# EAGLE design Controller (EAGLE 9.1.1)
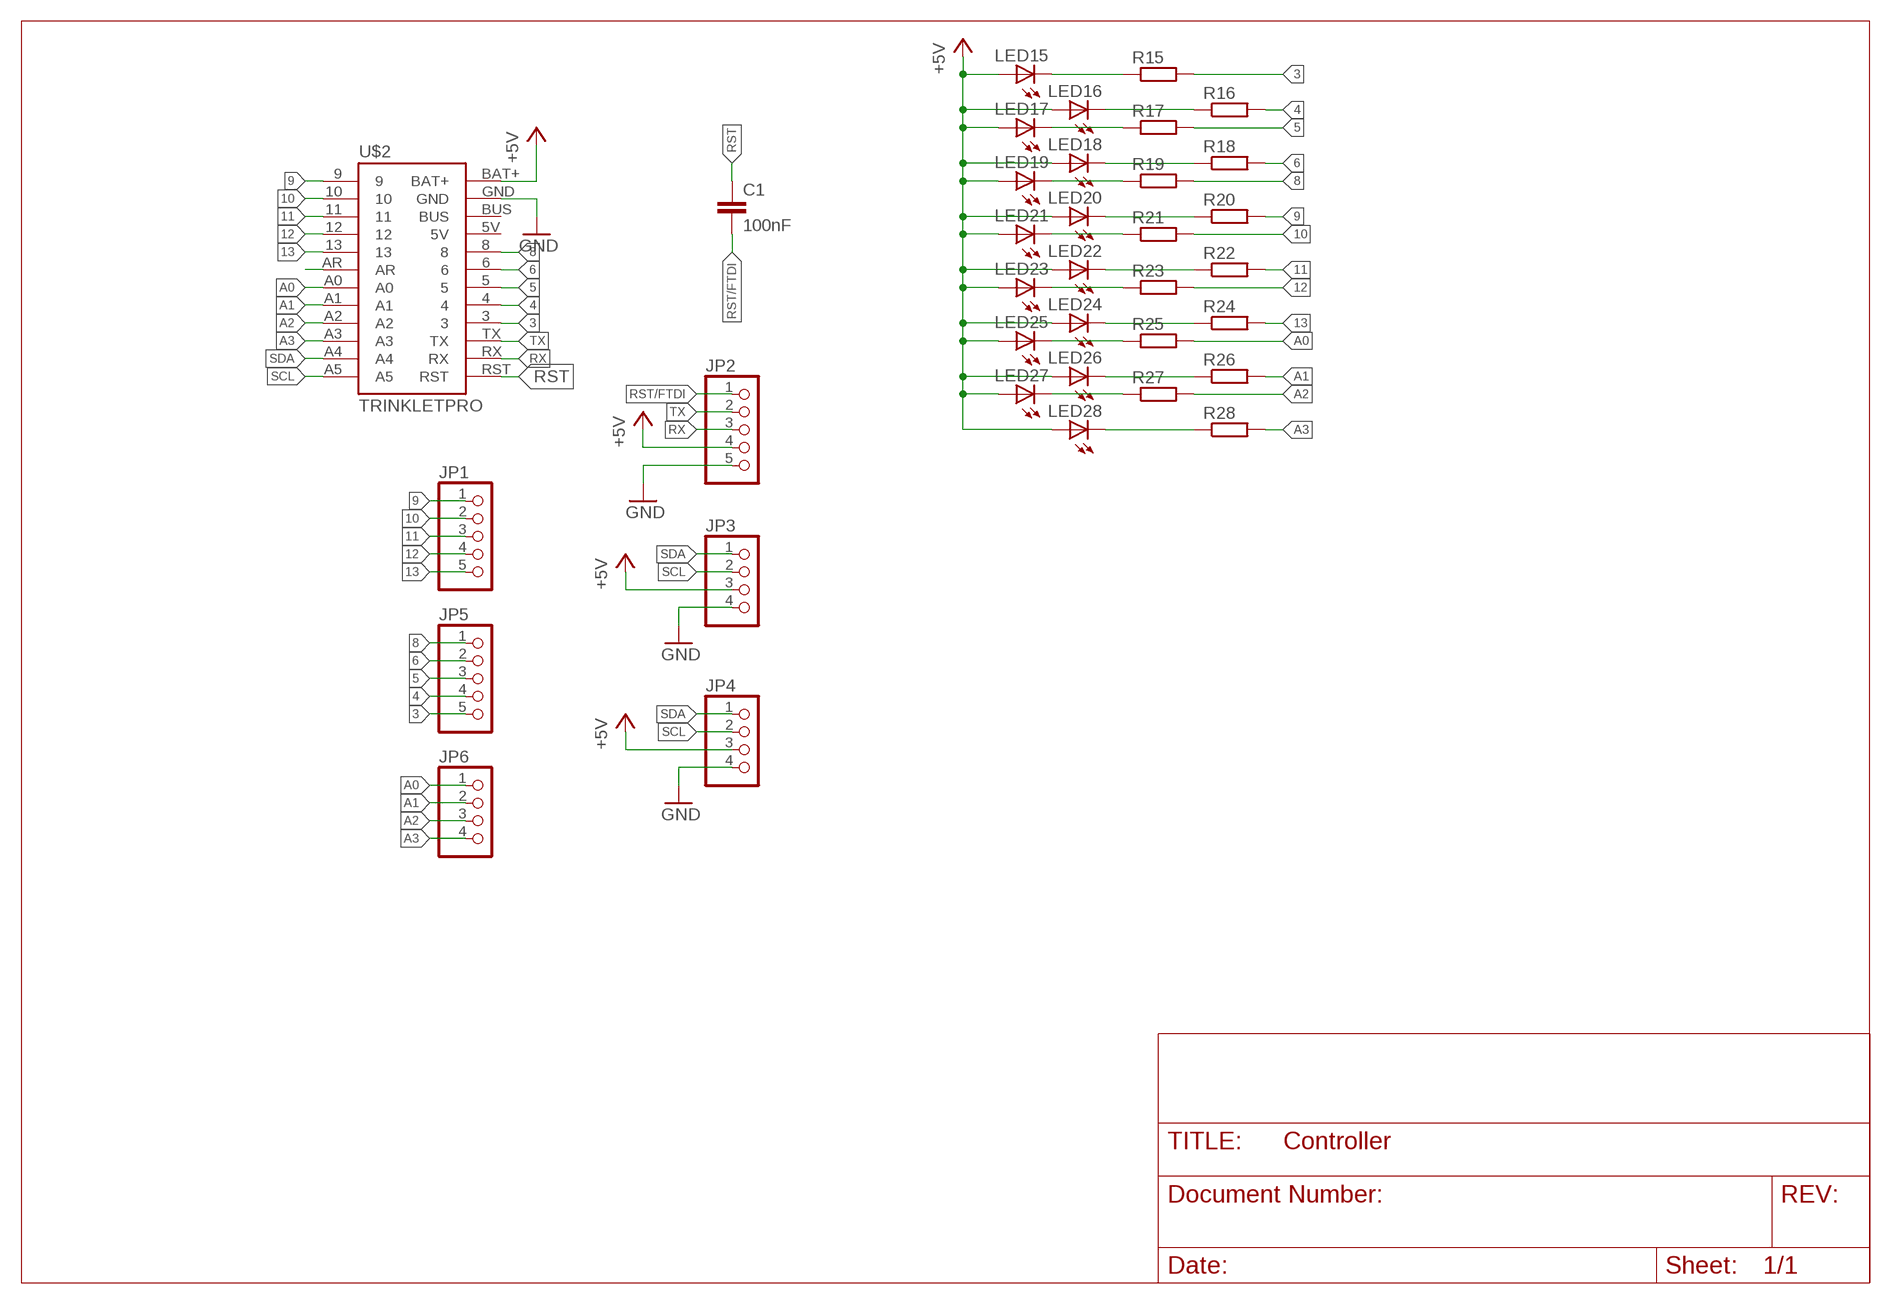
[diagram p0: schematic, sheet 1]

## Parts
C1  100nF  C-EUC0805  [C0805]
JP1  PINHD-1X5  [1X05]
JP2  PINHD-1X5  [1X05]
JP3  PINHD-1X4  [1X04]
JP4  PINHD-1X4  [1X04]
JP5  PINHD-1X5  [1X05]
JP6  PINHD-1X4  [1X04]
LED15  LEDCHIP-LED0805  [CHIP-LED0805]
LED16  LEDCHIP-LED0805  [CHIP-LED0805]
LED17  LEDCHIP-LED0805  [CHIP-LED0805]
LED18  LEDCHIP-LED0805  [CHIP-LED0805]
LED19  LEDCHIP-LED0805  [CHIP-LED0805]
LED20  LEDCHIP-LED0805  [CHIP-LED0805]
LED21  LEDCHIP-LED0805  [CHIP-LED0805]
LED22  LEDCHIP-LED0805  [CHIP-LED0805]
LED23  LEDCHIP-LED0805  [CHIP-LED0805]
LED24  LEDCHIP-LED0805  [CHIP-LED0805]
LED25  LEDCHIP-LED0805  [CHIP-LED0805]
LED26  LEDCHIP-LED0805  [CHIP-LED0805]
LED27  LEDCHIP-LED0805  [CHIP-LED0805]
LED28  LEDCHIP-LED0805  [CHIP-LED0805]
R15  R-EU_R0805  [R0805]
R16  R-EU_R0805  [R0805]
R17  R-EU_R0805  [R0805]
R18  R-EU_R0805  [R0805]
R19  R-EU_R0805  [R0805]
R20  R-EU_R0805  [R0805]
R21  R-EU_R0805  [R0805]
R22  R-EU_R0805  [R0805]
R23  R-EU_R0805  [R0805]
R24  R-EU_R0805  [R0805]
R25  R-EU_R0805  [R0805]
R26  R-EU_R0805  [R0805]
R27  R-EU_R0805  [R0805]
R28  R-EU_R0805  [R0805]
U$2  TRINKLETPRO  [1X12]

## Nets
3: JP5.5 R15.2 U$2.3
4: JP5.4 R16.2 U$2.4
5: JP5.3 R17.2 U$2.5
6: JP5.2 R18.2 U$2.6
8: JP5.1 R19.2 U$2.8
9: JP1.1 R20.2 U$2.9
10: JP1.2 R21.2 U$2.10
11: JP1.3 R22.2 U$2.11
12: JP1.4 R23.2 U$2.12
13: JP1.5 R24.2 U$2.13
+5V: JP2.4 JP3.3 JP4.3 LED15.A LED16.A LED17.A LED18.A LED19.A LED20.A LED21.A LED22.A LED23.A LED24.A LED25.A LED26.A LED27.A LED28.A U$2.BAT+
A0: JP6.1 R25.2 U$2.A0
A1: JP6.2 R26.2 U$2.A1
A2: JP6.3 R27.2 U$2.A2
A3: JP6.4 R28.2 U$2.A3
GND: JP2.5 JP3.4 JP4.4 U$2.GND
N$16: U$2.AR
N$17: LED15.C R15.1
N$18: LED16.C R16.1
N$19: LED17.C R17.1
N$20: LED18.C R18.1
N$21: LED19.C R19.1
N$22: LED20.C R20.1
N$23: LED21.C R21.1
N$24: LED22.C R22.1
N$25: LED23.C R23.1
N$26: LED24.C R24.1
N$27: LED25.C R25.1
N$28: LED26.C R26.1
N$29: LED27.C R27.1
N$30: LED28.C R28.1
RST: C1.1 U$2.RST
RST/FTDI: C1.2 JP2.1
RX: JP2.3 U$2.RX
SCL: JP3.2 JP4.2 U$2.A5
SDA: JP3.1 JP4.1 U$2.A4
TX: JP2.2 U$2.TX
Unconnected: U$2.5V U$2.BUS

## Library data of the parts
C1 = rcl:C-EU: CAPACITOR, European symbol; SPICEPREFIX: C
JP1 JP2 JP5 = pinhead:PINHD-1X5: PIN HEADER
JP3 JP4 JP6 = pinhead:PINHD-1X4: PIN HEADER
LED15-LED28 = led:LED: LED OSRAM: - CHIPLED LG R971, LG N971, LY N971, LG Q971, LY Q971, LO R971, LY R971 LH N974, LH R974 LS Q976, LO Q976, LY Q976 LO Q996 - Hyper CHIPLED LW Q18S LB Q993, LB Q99A, LB R99A - SideLED LS A670, LO A670, LY A670, LG A670, LP A670 LB A673, LV A673, LT A673, LW A673 LH A674 LY A675 LS A676, LA A676, LO A676, LY A676, LW A676 LS A679, LY A679, LG A679 - Hyper Micro SIDELED® LS Y876, LA Y876, LO Y876, LY Y876 LT Y87S - SmartLED LW L88C, LW L88S LB L89C, LB L89S, LG L890 LS L89K, LO L89K, LY L89K LS L896, LA L896, LO L896, LY L896 - TOPLED LS T670, LO T670, LY T670, LG T670, LP T670 LSG T670, LSP T670, LSY T670, LOP T670, LYG T670 LG T671, LOG T671, LSG T671 LB T673, LV T673, LT T673, LW T673 LH T674 LS T676, LA T676, LO T676, LY T676, LB T676, LH T676, LSB T676, LW T676 LB T67C, LV T67C, LT T67C, LS T67K, LO T67K, LY T67K, LW E67C LS E67B, LA E67B, LO E67B, LY E67B, LB E67C, LV E67C, LT E67C LW T67C LS T679, LY T679, LG T679 LS T770, LO T770, LY T770, LG T770, LP T770 LB T773, LV T773, LT T773, LW T773 LH T774 LS E675, LA E675, LY E675, LS T675 LS T776, LA T776, LO T776, LY T776, LB T776 LHGB T686 LT T68C, LB T68C - Hyper Mini TOPLED® LB M676 - Mini TOPLED Santana® LG M470 LS M47K, LO M47K, LY M47K Source: http://www.osram.convergy.de LUXEON: - LUMILED® LXK2-PW12-R00, LXK2-PW12-S00, LXK2-PW14-U00, LXK2-PW14-V00 LXK2-PM12-R00, LXK2-PM12-S00, LXK2-PM14-U00 LXK2-PE12-Q00, LXK2-PE12-R00, LXK2-PE12-S00, LXK2-PE14-T00, LXK2-PE14-U00 LXK2-PB12-K00, LXK2-PB12-L00, LXK2-PB12-M00, LXK2-PB14-N00, LXK2-PB14-P00, LXK2-PB14-Q00 LXK2-PR12-L00, LXK2-PR12-M00, LXK2-PR14-Q00, LXK2-PR14-R00 LXK2-PD12-Q00, LXK2-PD12-R00, LXK2-PD12-S00 LXK2-PH12-R00, LXK2-PH12-S00 LXK2-PL12-P00, LXK2-PL12-Q00, LXK2-PL12-R00 Source: www.luxeon.com KINGBRIGHT: KA-3528ASYC Source: www.kingbright.com
R15-R28 = rcl:R-EU_: RESISTOR, European symbol; SPICEPREFIX: R
U$2 = KLAUS:TRINKLETPRO

## Board
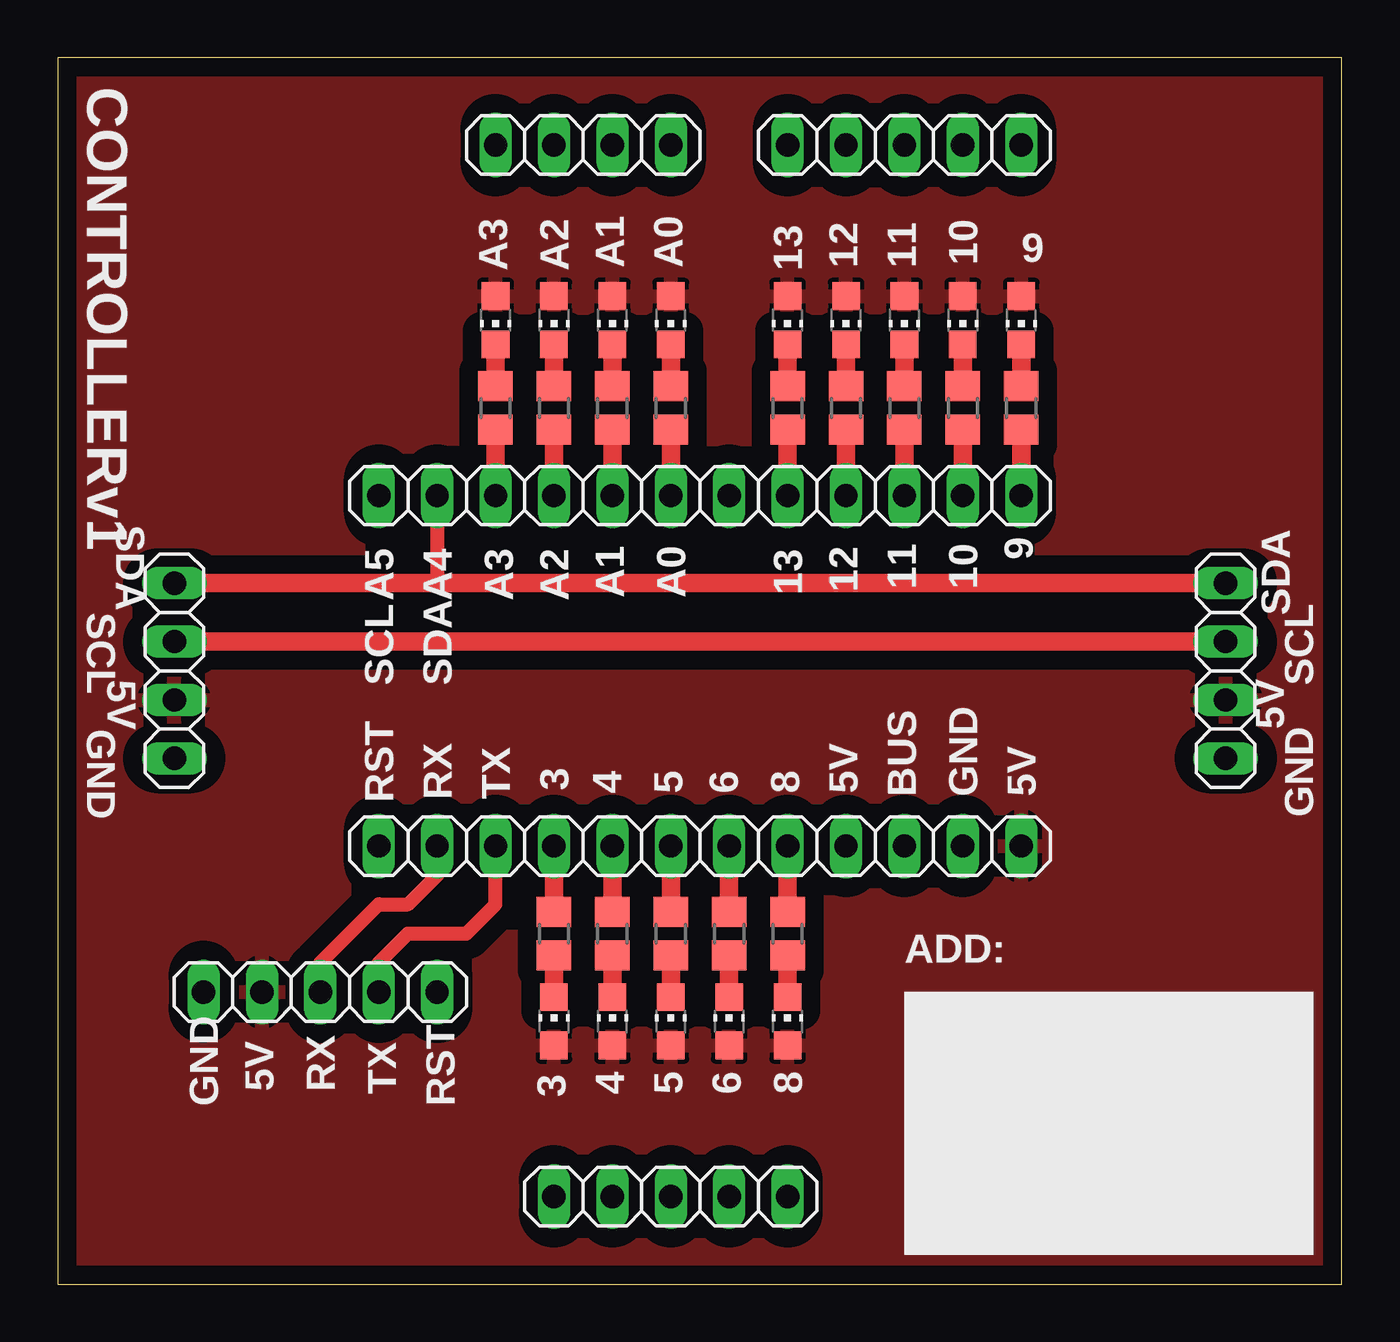
[diagram p1: board, top side]
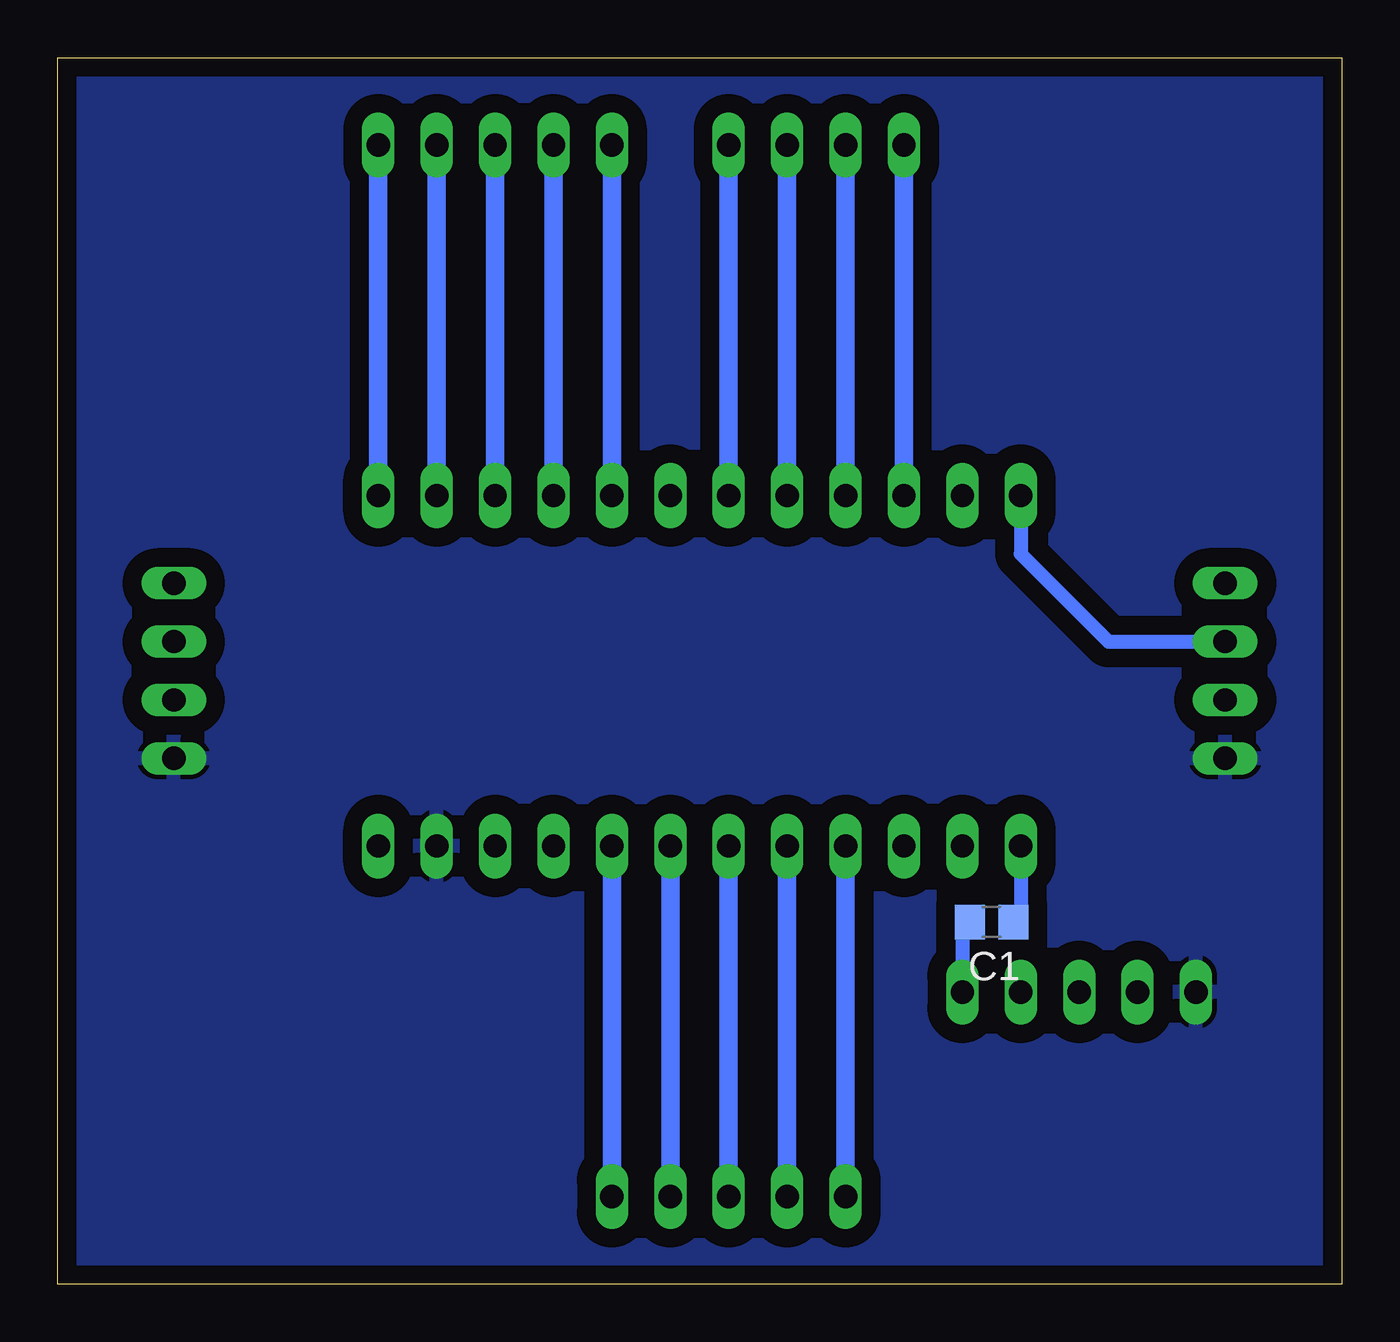
[diagram p2: board, bottom side, seen from below]

Size 55.86 x 53.34 mm. Coordinates in mm from the lower left corner, seen from the top.
Outline: 0,0 55.86,0 55.86,53.34 0,53.34 0,0
Copper layers (1*16): Top 0.035mm / dielectric 1.5mm / Bottom 0.035mm
Design rules "PCB-POOL Standard": minimum track width 0.15mm, minimum drill 0.3mm, track to track 0.15mm, track to pad 0.15mm, pad to pad 0.15mm, via to via 0.15mm, smd to smd 0.15mm, copper to edge 0.3mm, drill to drill 0.2mm, minimum pad ring 0.2mm, minimum via ring 0.15mm, stop-mask expansion 0.075mm, vias tented up to drill 0mil, thermal gap 0.2mm

### Footprints (pad centres in the part's own frame; a part is rotated, then mirrored left to right if it is on the bottom)
C0805 = smd 1.3 x 1.5: 1 -0.95,0; 2 0.95,0
1X05 = drill 1.016 long: 1 -5.08,0; 2 -2.54,0; 3 0,0; 4 2.54,0; 5 5.08,0
1X04 = drill 1.016 long: 1 -3.81,0; 2 -1.27,0; 3 1.27,0; 4 3.81,0
CHIP-LED0805 = smd 1.2 x 1.2: A 0,-1.05; C 0,1.05
R0805 = smd 1.3 x 1.5: 1 -0.95,0; 2 0.95,0
1X12 = drill 1.016 long: 3 7.62,-6.35; 4 7.62,-3.81; 5 7.62,-1.27; 5V 7.62,6.35; 6 7.62,1.27; 8 7.62,3.81; 9 -7.62,13.97; 10 -7.62,11.43; 11 -7.62,8.89; 12 -7.62,6.35; 13 -7.62,3.81; A0 -7.62,-1.27; A1 -7.62,-3.81; A2 -7.62,-6.35; A3 -7.62,-8.89; A4 -7.62,-11.43; A5 -7.62,-13.97; AR -7.62,1.27; BAT+ 7.62,13.97; BUS 7.62,8.89; GND 7.62,11.43; RST 7.62,-13.97; RX 7.62,-11.43; TX 7.62,-8.89

### Placement (x,y rotation side)
C1  15.24,15.75 180 bottom
JP1  36.83,49.53 180 top
JP2  11.43,12.7 180 top
JP3  5.08,26.67 270 top
JP4  50.8,26.67 270 top
JP5  26.67,3.81 180 top
JP6  22.86,49.53 180 top
LED15  21.59,11.43 0 top
LED16  24.13,11.43 0 top
LED17  26.67,11.43 0 top
LED18  29.21,11.43 0 top
LED19  31.75,11.43 0 top
LED20  41.91,41.91 180 top
LED21  39.37,41.91 180 top
LED22  36.83,41.91 180 top
LED23  34.29,41.91 180 top
LED24  31.75,41.91 180 top
LED25  26.67,41.91 180 top
LED26  24.13,41.91 180 top
LED27  21.59,41.91 180 top
LED28  19.05,41.91 180 top
R15  21.59,15.24 90 top
R16  24.13,15.24 90 top
R17  26.67,15.24 90 top
R18  29.21,15.24 90 top
R19  31.75,15.24 90 top
R20  41.91,38.1 270 top
R21  39.37,38.1 270 top
R22  36.83,38.1 270 top
R23  34.29,38.1 270 top
R24  31.75,38.1 270 top
R25  26.67,38.1 270 top
R26  24.13,38.1 270 top
R27  21.59,38.1 270 top
R28  19.05,38.1 270 top
U$2  27.94,26.67 270 top

### Tracks (layer width: path | path; a pad name or v marks a point on that pad's centre or on a via)
3
  Top 0.813: U$2.3 R15.2
  Bottom 0.813: U$2.3 JP5.5
4
  Top 0.813: U$2.4 R16.2
  Bottom 0.813: U$2.4 JP5.4
5
  Top 0.813: U$2.5 R17.2
  Bottom 0.813: U$2.5 JP5.3
6
  Top 0.813: U$2.6 R18.2
  Bottom 0.813: U$2.6 JP5.2
8
  Top 0.813: U$2.8 R19.2
  Bottom 0.813: U$2.8 JP5.1
9
  Top 0.813: U$2.9 R20.2
  Bottom 0.813: U$2.9 JP1.1
10
  Top 0.813: U$2.10 R21.2
  Bottom 0.813: U$2.10 JP1.2
11
  Top 0.813: U$2.11 R22.2
  Bottom 0.813: U$2.11 JP1.3
12
  Top 0.813: U$2.12 R23.2
  Bottom 0.813: U$2.12 JP1.4
13
  Top 0.813: U$2.13 R24.2
  Bottom 0.813: U$2.13 JP1.5
+5V
  pour Top (isolate 0.813): 0,53.34 55.88,53.34 55.88,0 0,0
A0
  Top 0.813: U$2.A0 R25.2
  Bottom 0.813: U$2.A0 JP6.1
A1
  Top 0.813: U$2.A1 R26.2
  Bottom 0.813: U$2.A1 JP6.2
A2
  Top 0.813: U$2.A2 R27.2
  Bottom 0.813: U$2.A2 JP6.3
A3
  Top 0.813: U$2.A3 R28.2
  Bottom 0.813: U$2.A3 JP6.4
GND
  pour Bottom (isolate 0.813): 0,53.34 55.88,53.34 55.88,0 0,0
N$17
  Top 0.813: R15.1 LED15.C
N$18
  Top 0.813: R16.1 LED16.C
N$19
  Top 0.813: R17.1 LED17.C
N$20
  Top 0.813: R18.1 LED18.C
N$21
  Top 0.813: R19.1 LED19.C
N$22
  Top 0.813: R20.1 LED20.C
N$23
  Top 0.813: R21.1 LED21.C
N$24
  Top 0.813: R22.1 LED22.C
N$25
  Top 0.813: R23.1 LED23.C
N$26
  Top 0.813: R24.1 LED24.C
N$27
  Top 0.813: R25.1 LED25.C
N$28
  Top 0.813: R26.1 LED26.C
N$29
  Top 0.813: R27.1 LED27.C
N$30
  Top 0.813: R28.1 LED28.C
RST
  Bottom 0.61: U$2.RST 13.97,16.07 C1.1
RST/FTDI
  Bottom 0.61: C1.2 16.51,15.43 JP2.1
RX
  Top 0.61: JP2.3 11.43,13.97 13.97,16.51 15.24,16.51 16.51,17.78 U$2.RX
SCL
  Top 0.813: JP3.2 JP4.2
  Bottom 0.61: U$2.A5 13.97,31.75 10.16,27.94 JP3.2
SDA
  Top 0.61: U$2.A4 16.51,30.48
  Top 0.813: JP3.1 16.51,30.48 JP4.1
TX
  Top 0.61: JP2.2 13.97,13.97 15.24,15.24 17.78,15.24 19.05,16.51 U$2.TX

### Text on the board
tPlace: CONTROLLERv1 | A3 | A2 | A1 | A0 | 13 | 12 | 11 | 10 | 9 | SDA | 9 | A5 | A4 | A3 | A2 | A1 | A0 | 13 | 12 | 11 | 10 | SCL | SDA | 5V | SCL | SDA | SCL | GND | 5V | RST | RX | TX | 3 | 4 | 5 | 6 | 8 | 5V | BUS | GND | 5V | GND | ADD: | GND | 5V | RX | TX | RST | 3 | 4 | 5 | 6 | 8